# EAGLE schematic Laser Cutter TinkerAccess (EAGLE 9.6.2)
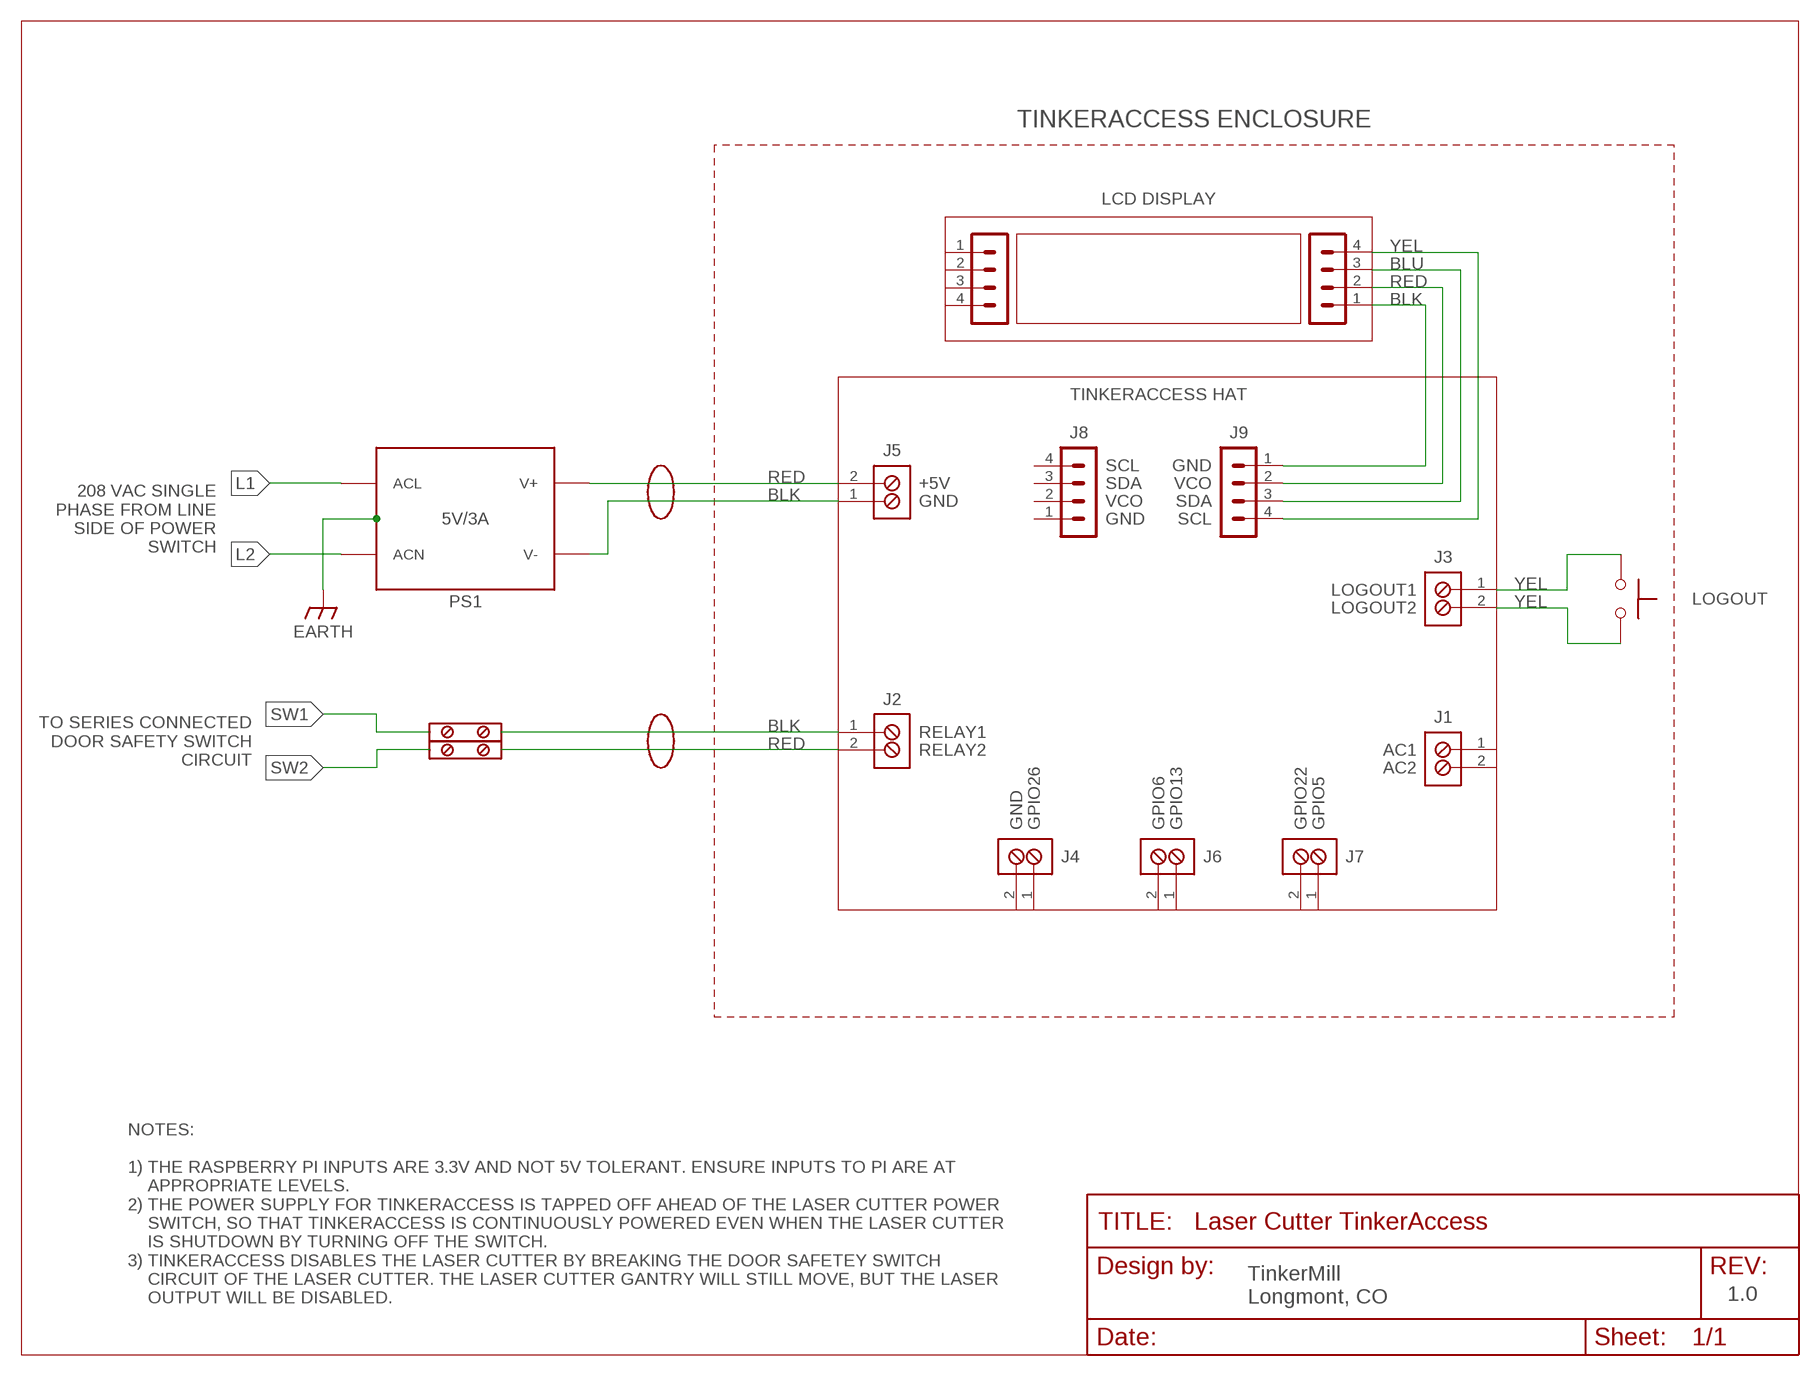
[diagram p0: schematic, sheet 1]

## Parts
J1  TB_2X1_TE_CONN_ED555_2DS  [TE_CONN_ED555_2DS]
J2  TB_2X1_TE_CONN_ED555_2DS  [TE_CONN_ED555_2DS]
J3  TB_2X1_TE_CONN_ED555_2DS  [TE_CONN_ED555_2DS]
J4  TB_2X1_TE_CONN_ED555_2DS  [TE_CONN_ED555_2DS]
J5  TB_2X1_TE_CONN_ED555_2DS  [TE_CONN_ED555_2DS]
J6  TB_2X1_TE_CONN_ED555_2DS  [TE_CONN_ED555_2DS]
J7  TB_2X1_TE_CONN_ED555_2DS  [TE_CONN_ED555_2DS]
J8  HDR_4X1_2.54MM_LOCKING_RA  [HDR_4X1_2.54MM_LOCKING_RA]
J9  HDR_4X1_2.54MM_LOCKING_RA  [HDR_4X1_2.54MM_LOCKING_RA]
J21  HDR_4X1_2.54MM_LOCKING_RA  [HDR_4X1_2.54MM_LOCKING_RA]
J22  HDR_4X1_2.54MM_LOCKING_RA  [HDR_4X1_2.54MM_LOCKING_RA]
PS1  5V/3A  POWER_SUPPLY  (no package)
SW3  LOGOUT  PUSHBUTTON_MOMENTARY_NO_OMRON_B3F_6MM  [OMRON_B3F_6MM]
TB3  TERMINAL_BLOCK  (no package)
TB4  TERMINAL_BLOCK  (no package)

## Nets
BLK1: J5.1 PS1.V-
BLK2: J2.1 TB3.B
L1: PS1.ACL
L2: PS1.ACN
LCD-GND: J9.1 J22.1
LCD-SCL: J9.4 J22.4
LCD-SDA: J9.3 J22.3
LCD-VCO: J9.2 J22.2
LOGOUT1: J3.1 SW3.1 SW3.2
LOGOUT2: J3.2 SW3.3 SW3.4
RED1: J5.2 PS1.V+
RED2: J2.2 TB4.B
SW1: TB3.A
SW2: TB4.A
Unconnected: J1.1 J1.2 J4.1 J4.2 J6.1 J6.2 J7.1 J7.2 J8.1 J8.2 J8.3 J8.4 J21.1 J21.2 J21.3 J21.4

## Notes on the sheet
- TINKERACCESS ENCLOSURE
- LCD DISPLAY
- YEL
- BLU
- RED
- BLK
- TINKERACCESS HAT
- SCL | GND
- RED | +5V | SDA | VCO
- BLK | GND | VCO | SDA
- 208 VAC SINGLE
  PHASE FROM LINE
  SIDE OF POWER
  SWITCH
- GND | SCL
- LOGOUT1 | YEL
- LOGOUT2 | YEL
- BLK | RELAY1
- TO SERIES CONNECTED
  DOOR SAFETY SWITCH
  CIRCUIT
- RED | RELAY2 | AC1
- AC2
- GND | GPIO26 | GPIO6 | GPIO13 | GPIO22 | GPIO5
- NOTES:
  
  1) THE RASPBERRY PI INPUTS ARE 3.3V AND NOT 5V TOLERANT. ENSURE INPUTS TO PI ARE AT
      APPROPRIATE LEVELS.
  2) THE POWER SUPPLY FOR TINKERACCESS IS TAPPED OFF AHEAD OF THE LASER CUTTER POWER
      SWITCH, SO THAT TINKERACCESS IS CONTINUOUSLY POWERED EVEN WHEN THE LASER CUTTER
      IS SHUTDOWN BY TURNING OFF THE SWITCH.
  3) TINKERACCESS DISABLES THE LASER CUTTER BY BREAKING THE DOOR SAFETEY SWITCH
      CIRCUIT OF THE LASER CUTTER. THE LASER CUTTER GANTRY WILL STILL MOVE, BUT THE LASER
      OUTPUT WILL BE DISABLED.
- TinkerMill
  Longmont, CO
- 1.0

## Library data of the parts
J1-J7 = TMF_Connectors:TB_2X1
J8 J9 J21 J22 = TMF_Connectors:HDR_4X1
PS1 = TMF_Schematic_Only:POWER_SUPPLY
SW3 = TMF_Switches:PUSHBUTTON_MOMENTARY_NO
TB3 TB4 = TMF_Schematic_Only:TERMINAL_BLOCK